# EAGLE design 180dof-pb (EAGLE 5.04)
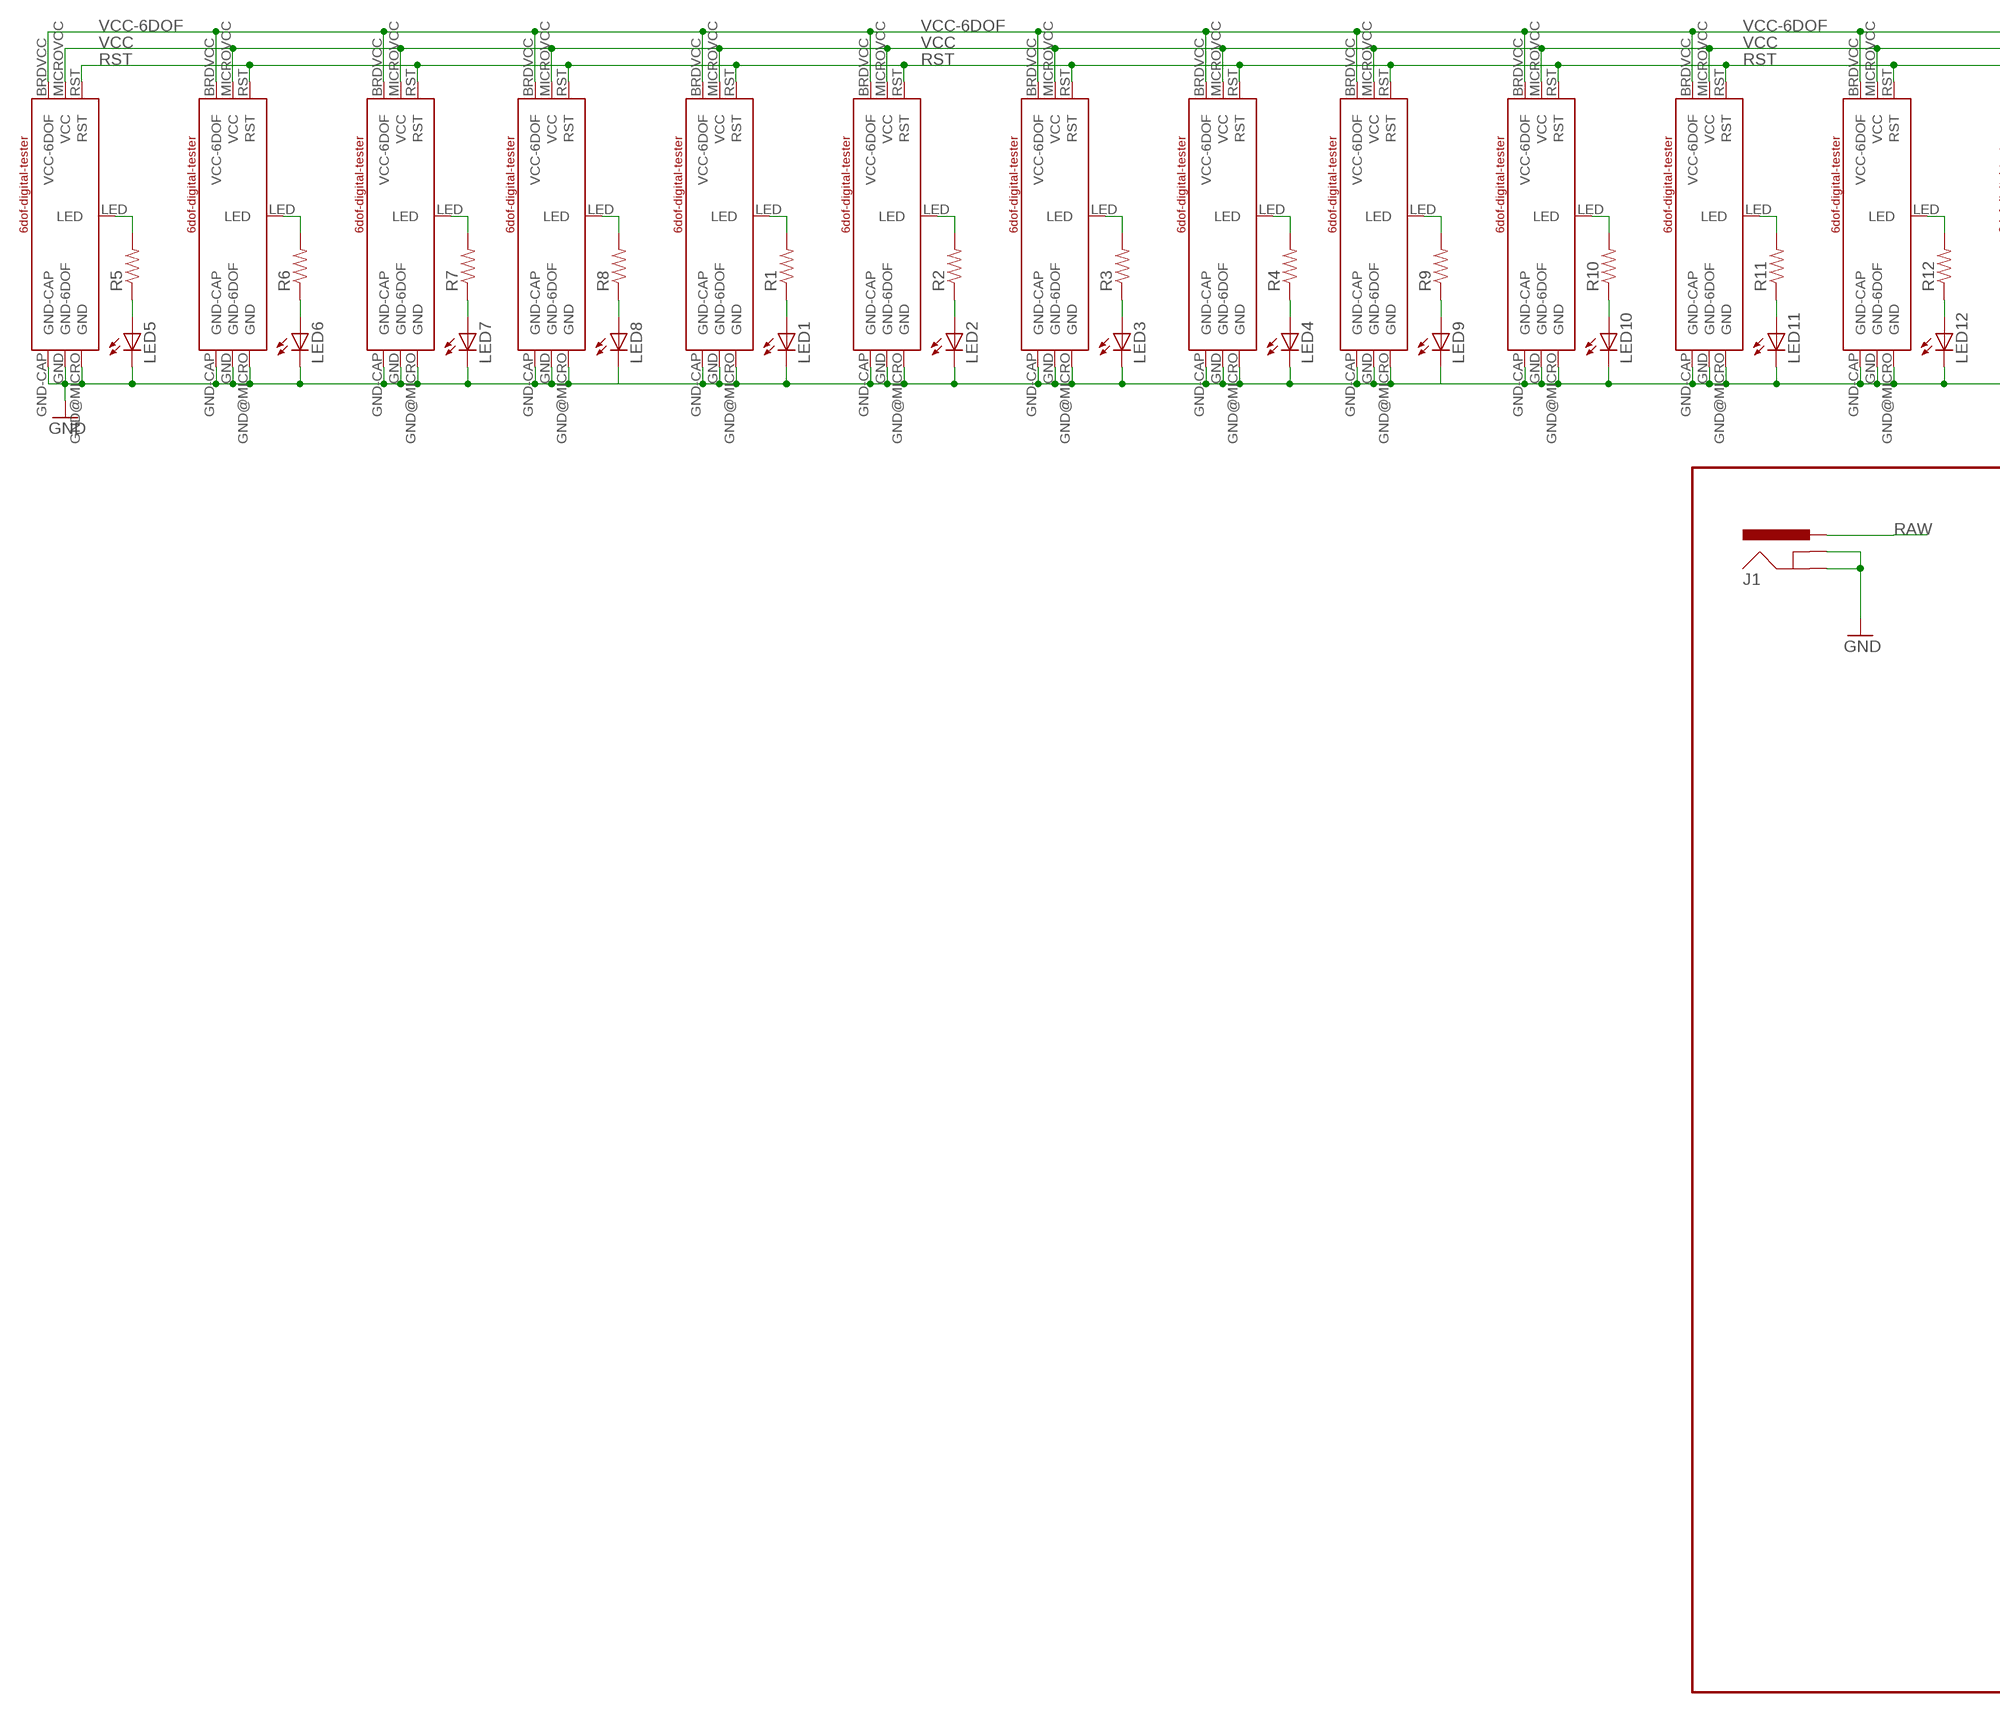
[diagram p0: schematic, sheet 1, part 1 of 2]
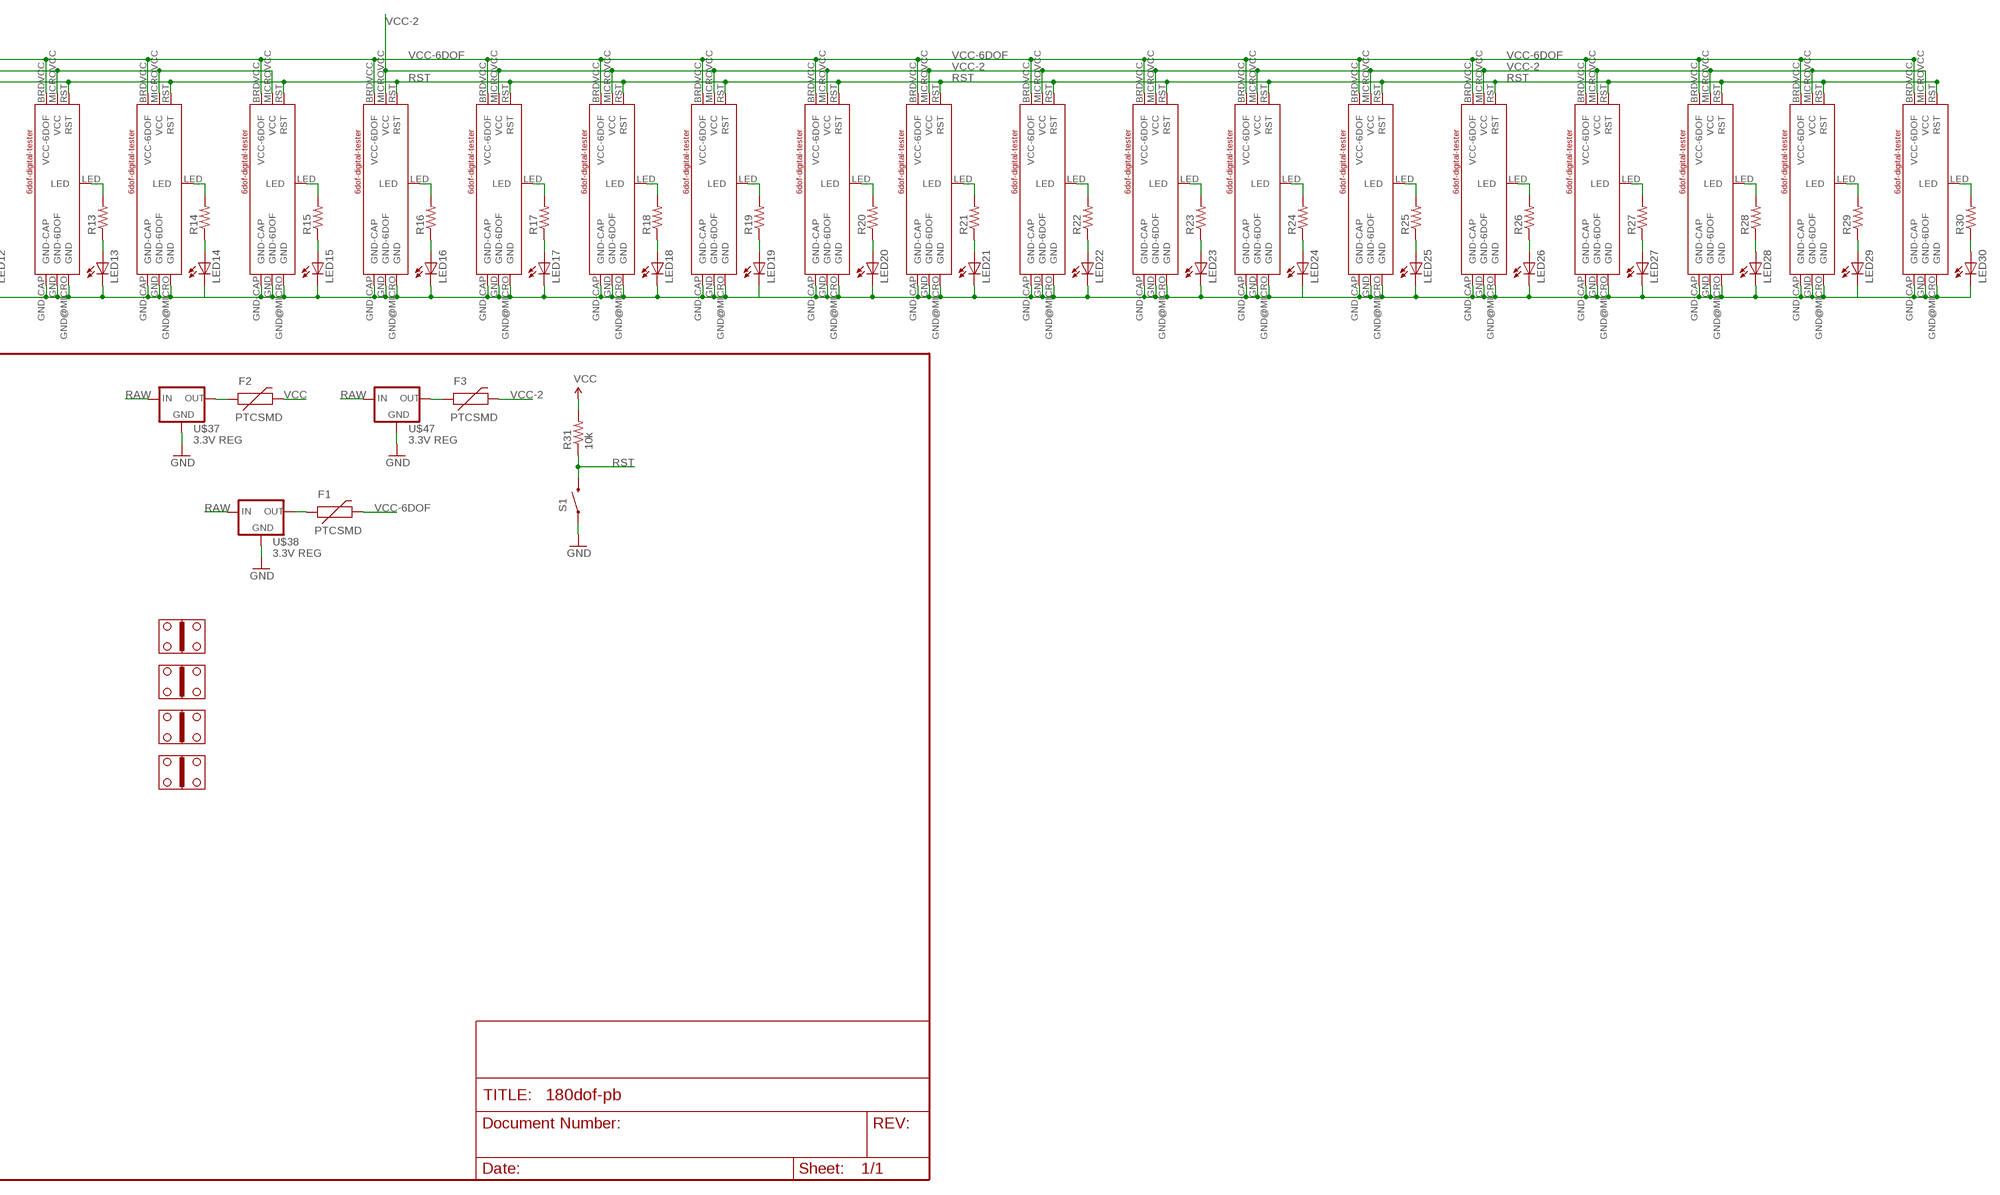
[diagram p1: schematic, sheet 1, part 2 of 2]

## Parts
F1  PTCSMD  [PTC-1206]
F2  PTCSMD  [PTC-1206]
F3  PTCSMD  [PTC-1206]
J1  POWER_JACKPTH  [POWER_JACK_PTH]
LED1  LED1206  [LED-1206]
LED2  LED1206  [LED-1206]
LED3  LED1206  [LED-1206]
LED4  LED1206  [LED-1206]
LED5  LED1206  [LED-1206]
LED6  LED1206  [LED-1206]
LED7  LED1206  [LED-1206]
LED8  LED1206  [LED-1206]
LED9  LED1206  [LED-1206]
LED10  LED1206  [LED-1206]
LED11  LED1206  [LED-1206]
LED12  LED1206  [LED-1206]
LED13  LED1206  [LED-1206]
LED14  LED1206  [LED-1206]
LED15  LED1206  [LED-1206]
LED16  LED1206  [LED-1206]
LED17  LED1206  [LED-1206]
LED18  LED1206  [LED-1206]
LED19  LED1206  [LED-1206]
LED20  LED1206  [LED-1206]
LED21  LED1206  [LED-1206]
LED22  LED1206  [LED-1206]
LED23  LED1206  [LED-1206]
LED24  LED1206  [LED-1206]
LED25  LED1206  [LED-1206]
LED26  LED1206  [LED-1206]
LED27  LED1206  [LED-1206]
LED28  LED1206  [LED-1206]
LED29  LED1206  [LED-1206]
LED30  LED1206  [LED-1206]
R1  RESISTOR0603-RES  [0603-RES]
R2  RESISTOR0603-RES  [0603-RES]
R3  RESISTOR0603-RES  [0603-RES]
R4  RESISTOR0603-RES  [0603-RES]
R5  RESISTOR0603-RES  [0603-RES]
R6  RESISTOR0603-RES  [0603-RES]
R7  RESISTOR0603-RES  [0603-RES]
R8  RESISTOR0603-RES  [0603-RES]
R9  RESISTOR0603-RES  [0603-RES]
R10  RESISTOR0603-RES  [0603-RES]
R11  RESISTOR0603-RES  [0603-RES]
R12  RESISTOR0603-RES  [0603-RES]
R13  RESISTOR0603-RES  [0603-RES]
R14  RESISTOR0603-RES  [0603-RES]
R15  RESISTOR0603-RES  [0603-RES]
R16  RESISTOR0603-RES  [0603-RES]
R17  RESISTOR0603-RES  [0603-RES]
R18  RESISTOR0603-RES  [0603-RES]
R19  RESISTOR0603-RES  [0603-RES]
R20  RESISTOR0603-RES  [0603-RES]
R21  RESISTOR0603-RES  [0603-RES]
R22  RESISTOR0603-RES  [0603-RES]
R23  RESISTOR0603-RES  [0603-RES]
R24  RESISTOR0603-RES  [0603-RES]
R25  RESISTOR0603-RES  [0603-RES]
R26  RESISTOR0603-RES  [0603-RES]
R27  RESISTOR0603-RES  [0603-RES]
R28  RESISTOR0603-RES  [0603-RES]
R29  RESISTOR0603-RES  [0603-RES]
R30  RESISTOR0603-RES  [0603-RES]
R31  10k  RESISTOR0603-RES  [0603-RES]
S1  SWITCH-MOMENTARY-2PTH  [TACTILE-PTH]
U$1  6DOF-DIGITAL-TESTER-DEV  [6DOF-DIGITAL-TESTER]
U$2  6DOF-DIGITAL-TESTER-DEV  [6DOF-DIGITAL-TESTER]
U$3  6DOF-DIGITAL-TESTER-DEV  [6DOF-DIGITAL-TESTER]
U$4  6DOF-DIGITAL-TESTER-DEV  [6DOF-DIGITAL-TESTER]
U$5  6DOF-DIGITAL-TESTER-DEV  [6DOF-DIGITAL-TESTER]
U$6  6DOF-DIGITAL-TESTER-DEV  [6DOF-DIGITAL-TESTER]
U$7  6DOF-DIGITAL-TESTER-DEV  [6DOF-DIGITAL-TESTER]
U$8  6DOF-DIGITAL-TESTER-DEV  [6DOF-DIGITAL-TESTER]
U$9  6DOF-DIGITAL-TESTER-DEV  [6DOF-DIGITAL-TESTER]
U$10  6DOF-DIGITAL-TESTER-DEV  [6DOF-DIGITAL-TESTER]
U$11  6DOF-DIGITAL-TESTER-DEV  [6DOF-DIGITAL-TESTER]
U$12  6DOF-DIGITAL-TESTER-DEV  [6DOF-DIGITAL-TESTER]
U$13  6DOF-DIGITAL-TESTER-DEV  [6DOF-DIGITAL-TESTER]
U$14  6DOF-DIGITAL-TESTER-DEV  [6DOF-DIGITAL-TESTER]
U$15  6DOF-DIGITAL-TESTER-DEV  [6DOF-DIGITAL-TESTER]
U$16  6DOF-DIGITAL-TESTER-DEV  [6DOF-DIGITAL-TESTER]
U$17  6DOF-DIGITAL-TESTER-DEV  [6DOF-DIGITAL-TESTER]
U$18  6DOF-DIGITAL-TESTER-DEV  [6DOF-DIGITAL-TESTER]
U$19  6DOF-DIGITAL-TESTER-DEV  [6DOF-DIGITAL-TESTER]
U$20  6DOF-DIGITAL-TESTER-DEV  [6DOF-DIGITAL-TESTER]
U$21  6DOF-DIGITAL-TESTER-DEV  [6DOF-DIGITAL-TESTER]
U$22  6DOF-DIGITAL-TESTER-DEV  [6DOF-DIGITAL-TESTER]
U$23  6DOF-DIGITAL-TESTER-DEV  [6DOF-DIGITAL-TESTER]
U$24  6DOF-DIGITAL-TESTER-DEV  [6DOF-DIGITAL-TESTER]
U$25  6DOF-DIGITAL-TESTER-DEV  [6DOF-DIGITAL-TESTER]
U$26  6DOF-DIGITAL-TESTER-DEV  [6DOF-DIGITAL-TESTER]
U$27  6DOF-DIGITAL-TESTER-DEV  [6DOF-DIGITAL-TESTER]
U$28  6DOF-DIGITAL-TESTER-DEV  [6DOF-DIGITAL-TESTER]
U$29  6DOF-DIGITAL-TESTER-DEV  [6DOF-DIGITAL-TESTER]
U$30  6DOF-DIGITAL-TESTER-DEV  [6DOF-DIGITAL-TESTER]
U$37  3.3V REG  V_REG_LD1117VXX  [78XXL]
U$38  3.3V REG  V_REG_LD1117VXX  [78XXL]
U$47  3.3V REG  V_REG_LD1117VXX  [78XXL]
U$48  GOLD_HINDGESTANDARD  [GOLD_HINDGE]
U$49  GOLD_HINDGESTANDARD  [GOLD_HINDGE]
U$50  GOLD_HINDGESTANDARD  [GOLD_HINDGE]
U$51  GOLD_HINDGESTANDARD  [GOLD_HINDGE]

## Nets
GND: J1.GND J1.GNDBREAK LED1.C LED2.C LED3.C LED4.C LED5.C LED6.C LED7.C LED8.C LED9.C LED10.C LED11.C LED12.C LED13.C LED14.C LED15.C LED16.C LED17.C LED18.C LED19.C LED20.C LED21.C LED22.C LED23.C LED24.C LED25.C LED26.C LED27.C LED28.C LED29.C LED30.C S1.1 U$1.GND(GND-6DOF) U$1.GND-CAP U$1.GND@MICRO(GND) U$2.GND(GND-6DOF) U$2.GND-CAP U$2.GND@MICRO(GND) U$3.GND(GND-6DOF) U$3.GND-CAP U$3.GND@MICRO(GND) U$4.GND(GND-6DOF) U$4.GND-CAP U$4.GND@MICRO(GND) U$5.GND(GND-6DOF) U$5.GND-CAP U$5.GND@MICRO(GND) U$6.GND(GND-6DOF) U$6.GND-CAP U$6.GND@MICRO(GND) U$7.GND(GND-6DOF) U$7.GND-CAP U$7.GND@MICRO(GND) U$8.GND(GND-6DOF) U$8.GND-CAP U$8.GND@MICRO(GND) U$9.GND(GND-6DOF) U$9.GND-CAP U$9.GND@MICRO(GND) U$10.GND(GND-6DOF) U$10.GND-CAP U$10.GND@MICRO(GND) U$11.GND(GND-6DOF) U$11.GND-CAP U$11.GND@MICRO(GND) U$12.GND(GND-6DOF) U$12.GND-CAP U$12.GND@MICRO(GND) U$13.GND(GND-6DOF) U$13.GND-CAP U$13.GND@MICRO(GND) U$14.GND(GND-6DOF) U$14.GND-CAP U$14.GND@MICRO(GND) U$15.GND(GND-6DOF) U$15.GND-CAP U$15.GND@MICRO(GND) U$16.GND(GND-6DOF) U$16.GND-CAP U$16.GND@MICRO(GND) U$17.GND(GND-6DOF) U$17.GND-CAP U$17.GND@MICRO(GND) U$18.GND(GND-6DOF) U$18.GND-CAP U$18.GND@MICRO(GND) U$19.GND(GND-6DOF) U$19.GND-CAP U$19.GND@MICRO(GND) U$20.GND(GND-6DOF) U$20.GND-CAP U$20.GND@MICRO(GND) U$21.GND(GND-6DOF) U$21.GND-CAP U$21.GND@MICRO(GND) U$22.GND(GND-6DOF) U$22.GND-CAP U$22.GND@MICRO(GND) U$23.GND(GND-6DOF) U$23.GND-CAP U$23.GND@MICRO(GND) U$24.GND(GND-6DOF) U$24.GND-CAP U$24.GND@MICRO(GND) U$25.GND(GND-6DOF) U$25.GND-CAP U$25.GND@MICRO(GND) U$26.GND(GND-6DOF) U$26.GND-CAP U$26.GND@MICRO(GND) U$27.GND(GND-6DOF) U$27.GND-CAP U$27.GND@MICRO(GND) U$28.GND(GND-6DOF) U$28.GND-CAP U$28.GND@MICRO(GND) U$29.GND(GND-6DOF) U$29.GND-CAP U$29.GND@MICRO(GND) U$30.GND(GND-6DOF) U$30.GND-CAP U$30.GND@MICRO(GND) U$37.IN(GND) U$38.IN(GND) U$47.IN(GND)
N$1: R5.2 U$5.LED
N$2: LED5.A R5.1
N$3: R6.2 U$6.LED
N$4: LED6.A R6.1
N$5: R7.2 U$7.LED
N$6: LED7.A R7.1
N$7: R8.2 U$8.LED
N$8: LED8.A R8.1
N$9: R1.2 U$1.LED
N$10: LED1.A R1.1
N$11: R2.2 U$2.LED
N$12: LED2.A R2.1
N$13: R3.2 U$3.LED
N$14: LED3.A R3.1
N$15: R4.2 U$4.LED
N$16: LED4.A R4.1
N$17: R9.2 U$9.LED
N$18: LED9.A R9.1
N$19: R10.2 U$10.LED
N$20: LED10.A R10.1
N$21: R11.2 U$11.LED
N$22: LED11.A R11.1
N$23: R12.2 U$12.LED
N$24: LED12.A R12.1
N$25: R13.2 U$13.LED
N$26: LED13.A R13.1
N$27: R14.2 U$14.LED
N$28: LED14.A R14.1
N$29: R15.2 U$15.LED
N$30: LED15.A R15.1
N$31: R16.2 U$16.LED
N$32: LED16.A R16.1
N$33: R17.2 U$17.LED
N$34: LED17.A R17.1
N$35: R18.2 U$18.LED
N$36: LED18.A R18.1
N$37: R19.2 U$19.LED
N$38: LED19.A R19.1
N$39: R20.2 U$20.LED
N$40: LED20.A R20.1
N$41: LED30.A R30.1
N$42: R30.2 U$30.LED
N$43: R29.2 U$29.LED
N$44: LED29.A R29.1
N$45: LED28.A R28.1
N$46: R28.2 U$28.LED
N$47: R27.2 U$27.LED
N$48: LED27.A R27.1
N$49: R26.2 U$26.LED
N$50: LED26.A R26.1
N$51: R25.2 U$25.LED
N$52: LED25.A R25.1
N$53: R24.2 U$24.LED
N$54: LED24.A R24.1
N$55: R21.2 U$21.LED
N$56: LED21.A R21.1
N$57: R22.2 U$22.LED
N$58: LED22.A R22.1
N$59: R23.2 U$23.LED
N$60: LED23.A R23.1
N$61: F1.1 U$38.GND(OUT)
N$64: F2.1 U$37.GND(OUT)
N$65: F3.1 U$47.GND(OUT)
RAW: J1.PWR U$37.OUT(IN) U$38.OUT(IN) U$47.OUT(IN)
RST: R31.1 S1.3 U$1.RST U$2.RST U$3.RST U$4.RST U$5.RST U$6.RST U$7.RST U$8.RST U$9.RST U$10.RST U$11.RST U$12.RST U$13.RST U$14.RST U$15.RST U$16.RST U$17.RST U$18.RST U$19.RST U$20.RST U$21.RST U$22.RST U$23.RST U$24.RST U$25.RST U$26.RST U$27.RST U$28.RST U$29.RST U$30.RST
VCC: F2.2 R31.2 U$1.MICROVCC(VCC) U$2.MICROVCC(VCC) U$3.MICROVCC(VCC) U$4.MICROVCC(VCC) U$5.MICROVCC(VCC) U$6.MICROVCC(VCC) U$7.MICROVCC(VCC) U$8.MICROVCC(VCC) U$9.MICROVCC(VCC) U$10.MICROVCC(VCC) U$11.MICROVCC(VCC) U$12.MICROVCC(VCC) U$13.MICROVCC(VCC) U$14.MICROVCC(VCC) U$15.MICROVCC(VCC)
VCC-2: F3.2 U$16.MICROVCC(VCC) U$17.MICROVCC(VCC) U$18.MICROVCC(VCC) U$19.MICROVCC(VCC) U$20.MICROVCC(VCC) U$21.MICROVCC(VCC) U$22.MICROVCC(VCC) U$23.MICROVCC(VCC) U$24.MICROVCC(VCC) U$25.MICROVCC(VCC) U$26.MICROVCC(VCC) U$27.MICROVCC(VCC) U$28.MICROVCC(VCC) U$29.MICROVCC(VCC) U$30.MICROVCC(VCC)
VCC-6DOF: F1.2 U$1.BRDVCC(VCC-6DOF) U$2.BRDVCC(VCC-6DOF) U$3.BRDVCC(VCC-6DOF) U$4.BRDVCC(VCC-6DOF) U$5.BRDVCC(VCC-6DOF) U$6.BRDVCC(VCC-6DOF) U$7.BRDVCC(VCC-6DOF) U$8.BRDVCC(VCC-6DOF) U$9.BRDVCC(VCC-6DOF) U$10.BRDVCC(VCC-6DOF) U$11.BRDVCC(VCC-6DOF) U$12.BRDVCC(VCC-6DOF) U$13.BRDVCC(VCC-6DOF) U$14.BRDVCC(VCC-6DOF) U$15.BRDVCC(VCC-6DOF) U$16.BRDVCC(VCC-6DOF) U$17.BRDVCC(VCC-6DOF) U$18.BRDVCC(VCC-6DOF) U$19.BRDVCC(VCC-6DOF) U$20.BRDVCC(VCC-6DOF) U$21.BRDVCC(VCC-6DOF) U$22.BRDVCC(VCC-6DOF) U$23.BRDVCC(VCC-6DOF) U$24.BRDVCC(VCC-6DOF) U$25.BRDVCC(VCC-6DOF) U$26.BRDVCC(VCC-6DOF) U$27.BRDVCC(VCC-6DOF) U$28.BRDVCC(VCC-6DOF) U$29.BRDVCC(VCC-6DOF) U$30.BRDVCC(VCC-6DOF)

## Library data of the parts
F1-F3 = SparkFun:PTC: Resettable Fuse PTC Resettable Fuse. Spark Fun Electronics SKU : COM-08357
J1 = SparkFun:POWER_JACK: Power Jack This is the standard 5.5mm barrel jack for power. The PTH is the most common, proven, reliable, footprint. All others are experimental. The Slot footprint only works if the mill layer is transmitted to the PCB fab house so be warned. Spark Fun Electronics SKU : PRT-00119. Mating wall wart : TOL-00298 (and others)
LED1-LED30 = unclepetes:LED: LEDs Standard schematic elements and footprints for 5mm, 3mm, 1206, and 0603 sized LEDs. 5mm - Spark Fun Electronics SKU : COM-00529 (and others)
R1-R31 = SparkFun:RESISTOR: Resistor Basic schematic elements and footprints for 0603, 1206, and PTH resistors.
S1 = SparkFun:SWITCH-MOMENTARY-2
U$1-U$30 = unclepetes:6DOF-DIGITAL-TESTER-DEV
U$37 U$38 U$47 = SparkFun:V_REG_LD1117VXX: LD1117VXX voltage regulator. We carry the 3.3V version (COM-00526) in TO-220 package.
U$48-U$51 = JoelEB:GOLD_HINDGE

## Board
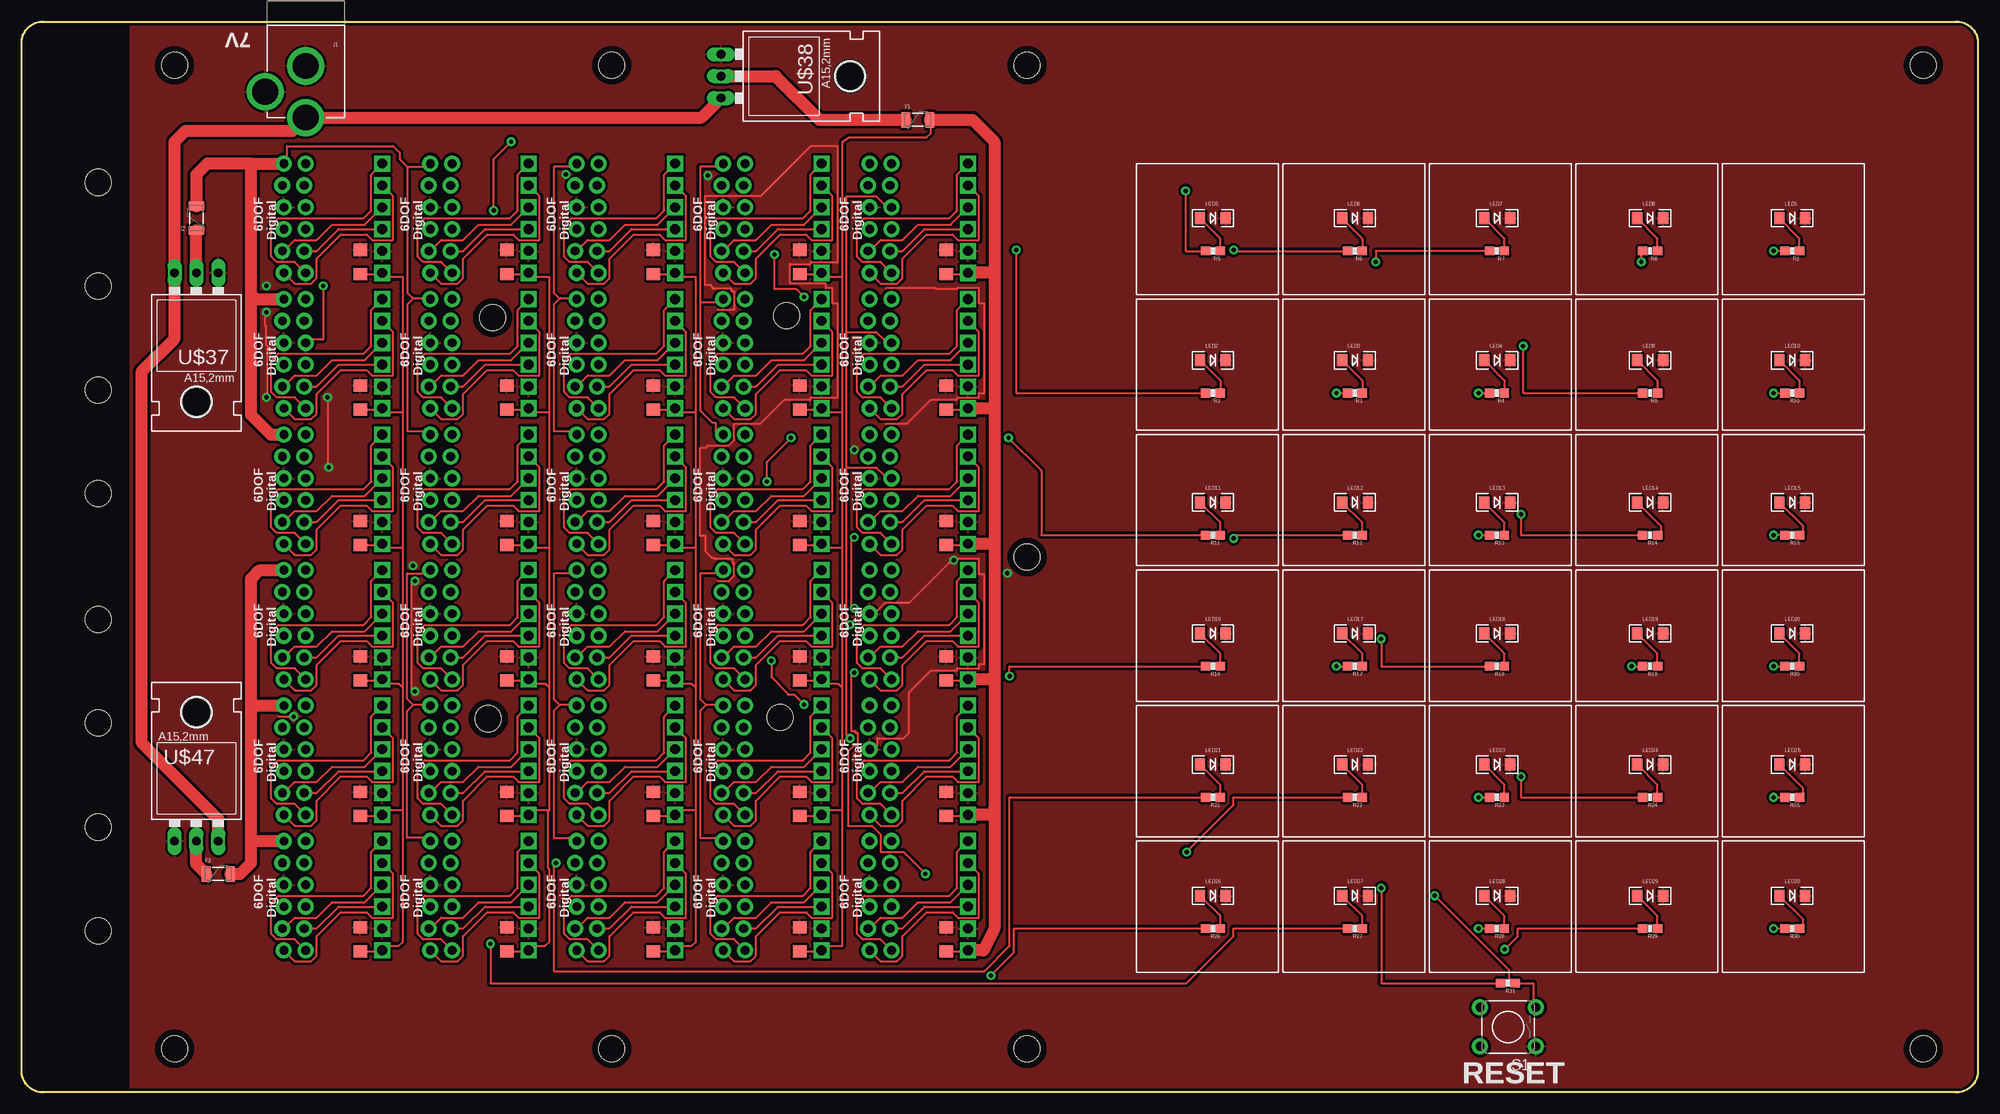
[diagram p2: board, top side]
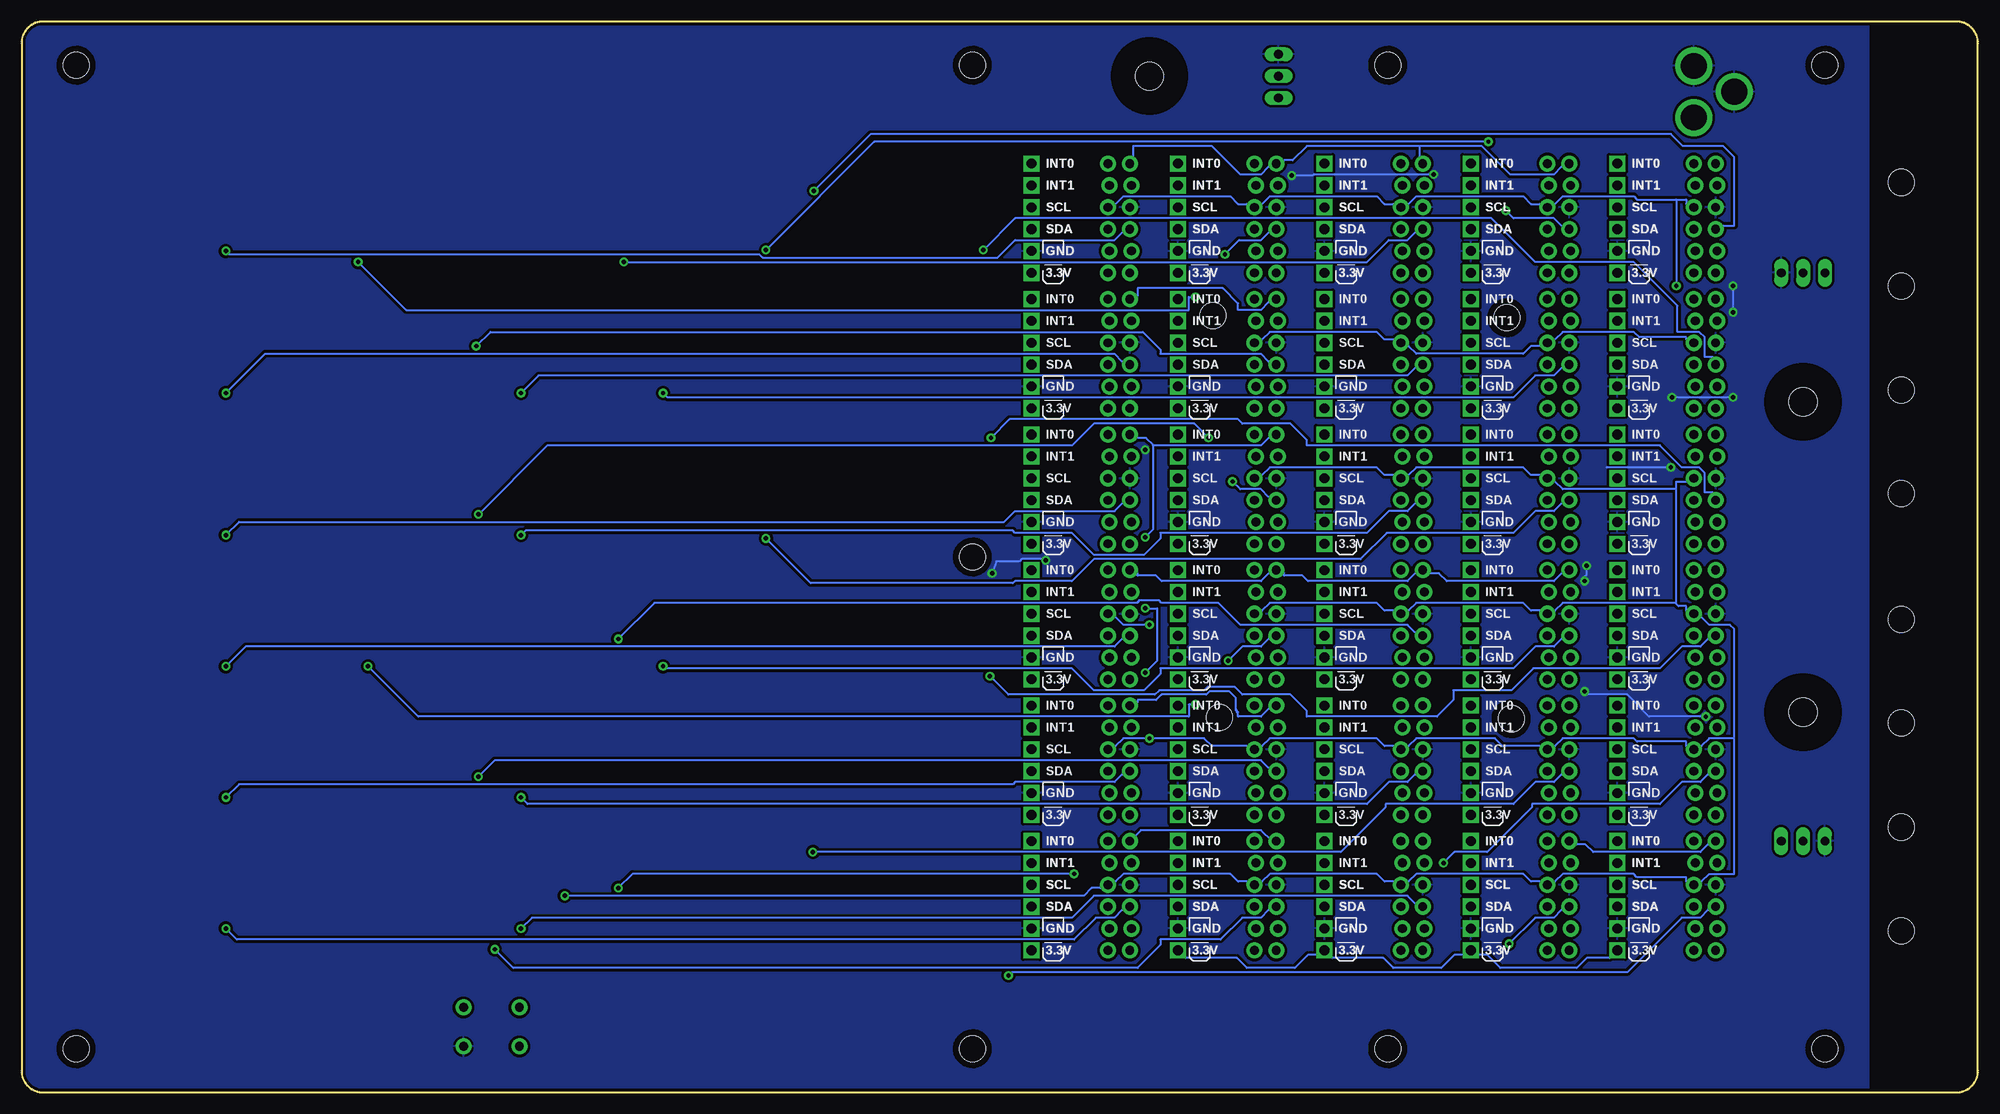
[diagram p3: board, bottom side, seen from below]

Size 227.33 x 124.46 mm. Coordinates in mm from the lower left corner, seen from the top.
Outline: 2.54,0 arc-90 0,2.54 0,121.92 arc-90 2.54,124.46 224.79,124.46 arc-90 227.33,121.92 227.33,2.54 arc-90 224.79,0 2.54,0
Copper layers (1*16): Top 0.035mm / dielectric 1.5mm / Bottom 0.035mm
Design rules "SparkFun *": minimum track width 10mil, minimum drill 20mil, track to track 8mil, track to pad 8mil, pad to pad 8mil, via to via 8mil, smd to smd 8mil, copper to edge 8mil, drill to drill 8mil, minimum pad ring 12mil, minimum via ring 10mil, stop-mask expansion 4mil, vias tented up to drill 20mil, thermal gap 10mil

### Footprints (pad centres in the part's own frame; a part is rotated, then mirrored left to right if it is on the bottom)
PTC-1206 = smd 1 x 1.8: 1 -1.4,0; 2 1.4,0
POWER_JACK_PTH = drill 2.997 pad 4.318 round: GND 0,7.7; GNDBREAK 4.7,10.7; PWR 0,13.7
LED-1206 = smd 1.2 x 1.4: A -1.5,0; C 1.5,0
0603-RES = smd 1.1 x 1: 1 -0.85,0; 2 0.85,0
TACTILE-PTH = drill 1.016 pad 1.88 round: 1 -3.251,2.261; 2 3.251,2.261; 3 -3.251,-2.261; 4 3.251,-2.261
6DOF-DIGITAL-TESTER = drill 1.118 pad 1.88 square: BRDVCC 15.24,1.27; GND 15.24,3.81; P$1 15.24,13.97; P$2 15.24,11.43; P$3 15.24,8.89; P$4 15.24,6.35 | smd 1.6 x 1.4: CAP-VCC 12.7,1.14; GND-CAP 12.7,3.94 | drill 1.016 pad 1.88 round: GND@MICRO 3.81,8.89; LED 3.81,6.35; MICROVCC 3.81,13.97; P2 3.632,11.43; P5 3.632,3.81; P6 3.81,1.27; P7 6.35,1.27; P8 6.172,3.81; P9 6.35,6.35; P11 6.172,11.43; P12 6.35,13.97; RST 6.35,8.89
STAND-OFF-TIGHT = hole 3.048: 0,0
78XXL = drill 1.016 long: GND 0,-3.81; IN -2.54,-3.81; OUT 2.54,-3.81 | hole 3.302: 0,11.176
GOLD_HINDGE = hole 3.048: 3.81,3.556; 3.81,15.591

### Placement (x,y rotation side)
F1  104.14,113.03 0 top
F2  20.32,101.6 90 top
F3  22.86,25.4 0 top
J1  33.02,127 180 top
LED1  205.74,101.6 0 top
LED2  138.43,85.09 0 top
LED3  154.94,85.09 0 top
LED4  171.45,85.09 0 top
LED5  138.43,101.6 0 top
LED6  154.94,101.6 0 top
LED7  171.45,101.6 0 top
LED8  189.23,101.6 0 top
LED9  189.23,85.09 0 top
LED10  205.74,85.09 0 top
LED11  138.43,68.58 0 top
LED12  154.94,68.58 0 top
LED13  171.45,68.58 0 top
LED14  189.23,68.58 0 top
LED15  205.74,68.58 0 top
LED16  138.43,53.34 0 top
LED17  154.94,53.34 0 top
LED18  171.45,53.34 0 top
LED19  189.23,53.34 0 top
LED20  205.74,53.34 0 top
LED21  138.43,38.1 0 top
LED22  154.94,38.1 0 top
LED23  171.45,38.1 0 top
LED24  189.23,38.1 0 top
LED25  205.74,38.1 0 top
LED26  138.43,22.86 0 top
LED27  154.94,22.86 0 top
LED28  171.45,22.86 0 top
LED29  189.23,22.86 0 top
LED30  205.74,22.86 0 top
R1  205.74,97.79 180 top
R2  138.43,81.28 180 top
R3  154.94,81.28 180 top
R4  171.45,81.28 180 top
R5  138.43,97.79 180 top
R6  154.94,97.79 180 top
R7  171.45,97.79 180 top
R8  189.23,97.79 180 top
R9  189.23,81.28 180 top
R10  205.74,81.28 180 top
R11  138.43,64.77 180 top
R12  154.94,64.77 180 top
R13  171.45,64.77 180 top
R14  189.23,64.77 180 top
R15  205.74,64.77 180 top
R16  138.43,49.53 180 top
R17  154.94,49.53 180 top
R18  171.45,49.53 180 top
R19  189.23,49.53 180 top
R20  205.74,49.53 180 top
R21  138.43,34.29 180 top
R22  154.94,34.29 180 top
R23  171.45,34.29 180 top
R24  189.23,34.29 180 top
R25  205.74,34.29 180 top
R26  138.43,19.05 180 top
R27  154.94,19.05 180 top
R28  171.45,19.05 180 top
R29  189.23,19.05 180 top
R30  205.74,19.05 180 top
R31  172.72,12.7 180 top
S1  172.72,7.62 180 top
U$1  94.74,93.98 0 top
U$2  26.67,78.23 0 top
U$3  43.69,78.23 0 top
U$4  60.71,78.23 0 top
U$5  26.67,93.98 0 top
U$6  43.69,93.98 0 top
U$7  60.71,93.98 0 top
U$8  77.72,93.98 0 top
U$9  77.72,78.23 0 top
U$10  94.74,78.23 0 top
U$11  26.67,62.48 0 top
U$12  43.69,62.48 0 top
U$13  60.71,62.48 0 top
U$14  77.72,62.48 0 top
U$15  94.74,62.48 0 top
U$16  26.67,46.74 0 top
U$17  43.69,46.74 0 top
U$18  60.71,46.74 0 top
U$19  77.72,46.74 0 top
U$20  94.74,46.74 0 top
U$21  26.67,30.99 0 top
U$22  43.69,30.99 0 top
U$23  60.71,30.99 0 top
U$24  77.72,30.99 0 top
U$25  94.74,30.99 0 top
U$26  26.67,15.24 0 top
U$27  43.69,15.24 0 top
U$28  60.71,15.24 0 top
U$29  77.72,15.24 0 top
U$30  94.74,15.24 0 top
U$32  [STAND-OFF-TIGHT]  116.84,119.38 0 top
U$33  [STAND-OFF-TIGHT]  116.84,62.23 0 top
U$34  [STAND-OFF-TIGHT]  220.98,119.38 0 top
U$35  [STAND-OFF-TIGHT]  220.98,5.08 0 top
U$36  [STAND-OFF-TIGHT]  88.14,43.56 0 top
U$37  20.32,91.44 180 top
U$38  85.09,118.11 270 top
U$39  [STAND-OFF-TIGHT]  54.74,90.04 0 top
U$40  [STAND-OFF-TIGHT]  88.9,90.3 0 top
U$41  [STAND-OFF-TIGHT]  17.78,5.08 0 top
U$42  [STAND-OFF-TIGHT]  68.58,5.08 0 top
U$43  [STAND-OFF-TIGHT]  116.84,5.08 0 top
U$44  [STAND-OFF-TIGHT]  17.78,119.38 0 top
U$45  [STAND-OFF-TIGHT]  68.58,119.38 0 top
U$46  [STAND-OFF-TIGHT]  54.23,43.43 0 top
U$47  20.32,33.02 0 top
U$48  5.08,90.17 0 top
U$49  5.08,66.04 0 top
U$50  5.08,39.37 0 top
U$51  5.08,15.24 0 top

### Tracks (layer width: path | path; a pad name or v marks a point on that pad's centre or on a via)
GND  (via drill 0.51)
  Top 0.254: v31.62,43.69 29.97,43.69 29.87,43.73 | v45.72,46.61 45.34,46.61 45.34,59.44 v45.72,59.44 | v35.69,72.64 35.56,72.77 v35.56,80.77 | v28.45,80.77 28.45,81.03 28.57,81.03 28.57,86.74 28.45,86.87 28.45,89.03 28.32,89.15 28.32,90.17 28.45,90.3 v28.45,90.68 | 84.45,104.14 85.85,104.14 91.69,109.98 94.87,109.98 94.87,96.52 91.69,96.52 91.69,96.27 89.28,96.27 89.28,94.11 89.41,94.11 89.41,93.98 93.47,93.98 93.47,93.47 94.23,93.47 94.23,91.69 94.87,91.69 94.87,80.77 91.69,80.77 91.69,80.52 88.65,80.52 85.85,77.72 82.8,77.72 82.8,75.82 82.17,75.18 79.76,75.18 79.5,74.93 78.87,74.93 78.87,64.64 79.5,64.64 79.5,62.87 80.26,62.1 80.52,62.1 80.52,61.98 82.68,61.98 82.68,61.47 82.8,61.47 82.8,60.07 82.17,59.44 81.03,59.44 80.93,59.47 | 84.45,104.14 79.38,104.14 79.38,93.85 80.01,93.85 80.26,93.6 80.26,93.47 82.42,93.47 82.42,93.22 82.55,93.22 82.55,93.09 82.8,93.09 82.8,90.93 81.03,90.93 80.93,90.97 | 100.45,93.42 100.46,93.47 106.17,93.47 106.3,93.34 108.71,93.34 108.71,93.47 111.25,93.47 111.25,91.69 111.89,91.69 111.89,81.28 111.25,81.28 111.25,80.77 108.71,80.77 108.71,80.52 105.66,80.52 102.87,77.72 100.46,77.72 100.45,77.67 | U$20.GND@MICRO 99.44,56.01 100.33,56.9 103.12,56.9 108.08,61.85 v108.33,61.85 108.71,61.85 108.71,61.98 111.25,61.98 111.25,60.2 111.89,60.2 111.89,49.78 111.25,49.78 111.25,49.28 108.71,49.28 108.71,49.02 105.66,49.02 103.12,46.48 103.12,41.78 102.49,41.15 99.44,41.15 99.44,40.26 U$25.GND@MICRO | 84.45,104.14 84.5,104.18
  Bottom 0.254: v31.62,43.69 38.23,43.69 40.77,46.23 45.34,46.23 v45.72,46.61 | v45.72,59.44 45.72,59.94 45.47,60.2 v45.47,61.21 | v28.45,80.77 v35.56,80.77 | v28.45,90.68 v28.45,93.73 | v35.69,72.64 43.13,72.64 | v114.55,60.33 114.05,61.72 111.38,61.72 111.12,61.98 108.46,61.98 v108.33,61.85 | v79.76,106.55 77.34,106.55 77.22,106.68 v63.25,106.68
  other vias: 96.77,74.68
  pour Bottom (isolate 0.305): 12.7,0 12.7,124.46 227.33,124.46 227.33,0
  pour Top (isolate 0.305): 12.7,0 12.7,124.46 227.33,124.46 227.33,0
N$1  (via drill 0.51)
  Top 0.254: v135.25,104.78 135.25,97.79 R5.2
  Bottom 0.254: v135.25,104.78 128.65,111.38 35.69,111.38 34.29,109.98 29.59,109.98 28.32,108.71 28.32,100.71 29.59,100.71 U$5.LED
N$2
  Top 0.254: R5.1 139.28,99.25 LED5.A
N$3  (via drill 0.51)
  Top 0.254: v140.84,97.92 140.84,97.79 R6.2 | v56.9,110.49 54.86,108.46 v54.86,102.49
  Bottom 0.254: v140.84,97.92 128.27,110.49 v56.9,110.49 | v54.86,102.49 53.98,101.6 49.28,101.6 48.39,100.71 U$6.LED
N$4
  Top 0.254: R6.1 155.79,99.25 LED6.A
N$5  (via drill 0.51)
  Top 0.254: v157.35,96.52 157.35,97.79 R7.2
  Bottom 0.254: v157.35,96.52 70.99,96.52 68.45,99.06 66.29,99.06 65.41,99.95 U$7.LED
N$6
  Top 0.254: R7.1 172.3,99.25 LED7.A
N$7  (via drill 0.51)
  Top 0.254: v188.21,96.52 188.21,97.41 R8.2 | v90.93,92.46 90.04,93.34 87.5,93.34 v87.5,97.41
  Bottom 0.254: v188.21,96.52 182.63,90.93 91.69,90.93 91.69,92.46 v90.93,92.46 | v87.5,97.41 85.85,99.06 83.31,99.06 82.42,99.95 U$8.LED
N$8
  Top 0.254: R8.1 190.08,99.25 LED8.A
N$9  (via drill 0.51)
  Top 0.254: R1.2 v203.58,97.79
  Bottom 0.254: v203.58,97.79 203.2,97.41 141.6,97.41 141.22,97.03 113.92,97.03 111.89,99.06 100.33,99.06 99.44,99.95 U$1.LED
N$10
  Top 0.254: R1.1 206.59,99.25 LED1.A
N$11  (via drill 0.51)
  Top 0.254: v115.57,97.92 115.57,81.28 R2.2
  Bottom 0.254: v115.57,97.92 111.89,101.6 56.52,101.6 51.44,96.52 40.01,96.52 34.92,91.44 34.92,88.39 32.38,88.39 31.75,87.76 31.75,85.47 30.86,85.47 U$2.LED
N$12
  Top 0.254: R2.1 139.28,82.74 LED2.A
N$13  (via drill 0.51)
  Top 0.254: v152.78,81.28 R3.2
  Bottom 0.254: v152.78,81.28 152.27,80.77 53.98,80.77 51.44,83.31 49.28,83.31 48.39,84.2 U$3.LED
N$14
  Top 0.254: R3.1 155.79,82.74 LED3.A
N$15  (via drill 0.51)
  Top 0.254: v169.29,81.28 R4.2
  Bottom 0.254: v169.29,81.28 167.26,83.31 66.29,83.31 65.41,84.2 U$4.LED
N$16
  Top 0.254: R4.1 172.3,82.74 LED4.A
N$17  (via drill 0.51)
  Top 0.254: v174.5,86.74 174.5,81.28 R9.2
  Bottom 0.254: v174.5,86.74 172.85,88.39 97.03,88.39 95,86.36 95,85.85 83.31,85.85 82.42,84.96 U$9.LED
N$18
  Top 0.254: R9.1 190.08,82.74 LED9.A
N$19  (via drill 0.51)
  Top 0.254: v203.58,81.28 R10.2
  Bottom 0.254: v203.58,81.28 199.01,85.85 100.33,85.85 99.44,84.96 U$10.LED
N$20
  Top 0.254: R10.1 206.59,82.74 LED10.A
N$21  (via drill 0.51)
  Top 0.254: v114.68,76.07 118.49,72.26 118.49,64.77 R11.2
  Bottom 0.254: v114.68,76.07 112.52,78.23 85.98,78.23 85.47,77.72 79.88,77.72 77.98,75.82 77.98,75.18 36.96,75.18 34.42,72.64 32.38,72.64 31.75,72.01 31.75,69.72 30.86,69.72 U$11.LED
N$22
  Top 0.254: R11.1 139.28,66.23 LED11.A
N$23  (via drill 0.51)
  Top 0.254: v140.84,64.39 140.84,64.77 R12.2
  Bottom 0.254: v140.84,64.39 135.64,59.18 112.14,59.18 111.89,59.44 105.28,59.44 102.74,61.98 71.75,61.98 68.71,65.02 53.98,65.02 51.44,67.56 49.28,67.56 48.39,68.45 U$12.LED
N$24
  Top 0.254: R12.1 155.79,66.23 LED12.A
N$25  (via drill 0.51)
  Top 0.254: v169.29,64.77 R13.2
  Bottom 0.254: v169.29,64.77 168.78,65.28 112.14,65.28 111.89,65.02 105.28,65.02 102.74,62.48 96.9,62.48 95,64.39 95,65.02 70.99,65.02 68.45,67.56 66.29,67.56 65.41,68.45 U$13.LED
N$26
  Top 0.254: R13.1 172.3,66.23 LED13.A
N$27  (via drill 0.51)
  Top 0.254: v174.24,67.18 174.24,64.77 R14.2 | v89.41,76.07 86.61,73.28 v86.61,70.99
  Bottom 0.254: v174.24,67.18 166.24,75.18 105.28,75.18 102.74,77.72 91.06,77.72 v89.41,76.07 | v86.61,70.99 85.72,70.1 83.31,70.1 82.42,69.22 U$14.LED
N$28
  Top 0.254: R14.1 190.5,64.77 190.5,65.81 LED14.A
N$29  (via drill 0.51)
  Top 0.254: R15.2 v203.58,64.77
  Bottom 0.254: v203.58,64.77 202.06,66.29 113.16,66.29 111.89,67.56 100.33,67.56 99.44,68.45 U$15.LED
N$30
  Top 0.254: R15.1 207.01,64.77 207.01,65.81 LED15.A
N$31  (via drill 0.51)
  Top 0.254: v114.81,48.39 114.81,49.53 R16.2
  Bottom 0.254: v114.81,48.39 112.65,46.23 95.63,46.23 95.12,46.74 89.92,46.74 89.53,47.12 86.36,47.12 85.47,46.23 79.88,46.23 77.98,44.32 77.98,43.69 62.87,43.69 60.96,45.59 60.96,46.74 54.23,46.74 51.69,49.28 36.96,49.28 34.42,51.82 32.26,51.82 31.37,52.7 U$16.LED
N$32
  Top 0.254: R16.1 139.28,50.99 LED16.A
N$33  (via drill 0.51)
  Top 0.254: v152.78,49.53 R17.2
  Bottom 0.254: v152.78,49.53 152.53,49.28 105.28,49.28 102.74,46.74 96.9,46.74 95,48.64 95,49.28 53.98,49.28 51.44,51.82 49.28,51.82 48.39,52.7 U$17.LED
N$34
  Top 0.254: R17.1 155.79,50.99 LED17.A
N$35  (via drill 0.51)
  Top 0.254: v157.99,52.7 157.99,49.53 R18.2
  Bottom 0.254: v157.99,52.7 153.8,56.9 97.66,56.9 97.66,57.02 97.54,57.02 97.54,57.15 95.12,57.15 94.87,56.9 88.27,56.9 85.72,54.36 66.29,54.36 65.41,53.47 U$18.LED
N$36
  Top 0.254: R18.1 172.3,50.99 LED18.A
N$37  (via drill 0.51)
  Top 0.254: v90.93,45.09 89.79,46.23 89.03,46.23 89.03,46.35 87.12,48.26 v87.12,50.16 | v187.07,49.53 R19.2
  Bottom 0.254: v187.07,49.53 181.23,43.69 91.69,43.69 91.69,45.09 v90.93,45.09 | v87.12,50.16 85.47,51.82 83.31,51.82 82.42,52.7 U$19.LED
N$38
  Top 0.254: R19.1 190.08,50.99 LED19.A
N$39  (via drill 0.51)
  Top 0.254: v203.58,49.53 R20.2
  Bottom 0.254: v203.58,49.53 201.29,51.82 100.33,51.82 99.44,52.7 U$20.LED
N$40
  Top 0.254: R20.1 206.59,50.99 LED20.A
N$41
  Top 0.254: R30.1 207.01,19.05 207.01,20.09 LED30.A
N$42  (via drill 0.51)
  Top 0.254: v203.58,19.05 R30.2
  Bottom 0.254: v203.58,19.05 202.31,17.78 105.03,17.78 102.49,20.32 100.33,20.32 99.44,21.21 U$30.LED
N$43  (via drill 0.51)
  Top 0.254: v172.34,16.64 173.86,18.16 173.86,19.05 R29.2
  Bottom 0.254: v172.34,16.64 170.18,14.48 97.66,14.48 95,17.14 95,17.78 88.01,17.78 85.47,20.32 83.31,20.32 82.42,21.21 U$29.LED
N$44
  Top 0.254: R29.1 190.08,20.51 LED29.A
N$45
  Top 0.254: R28.1 172.3,20.51 LED28.A
N$46  (via drill 0.51)
  Top 0.254: v169.29,19.05 R28.2
  Bottom 0.254: v169.29,19.05 168.02,20.32 105.28,20.32 102.74,22.86 66.29,22.86 65.41,21.97 U$28.LED
N$47  (via drill 0.51)
  Top 0.254: v54.48,17.27 54.48,12.7 135.38,12.7 140.84,18.16 140.84,19.05 R27.2
  Bottom 0.254: v54.48,17.27 51.44,20.32 49.28,20.32 48.39,21.21 U$27.LED
N$48
  Top 0.254: R27.1 155.79,20.51 LED27.A
N$49  (via drill 0.51)
  Top 0.254: v112.65,13.59 115.32,16.26 115.32,19.05 R26.2
  Bottom 0.254: v112.65,13.59 112.27,13.97 40.77,13.97 34.42,20.32 32.26,20.32 31.37,21.21 U$26.LED
N$50
  Top 0.254: R26.1 139.28,20.51 LED26.A
N$51  (via drill 0.51)
  Top 0.254: v203.58,34.29 R25.2
  Bottom 0.254: v203.58,34.29 202.06,35.81 112.14,35.81 111.89,36.07 100.33,36.07 99.44,36.96 U$25.LED
N$52
  Top 0.254: R25.1 207.01,34.29 207.01,35.33 LED25.A
N$53  (via drill 0.51)
  Top 0.254: v174.24,36.7 174.24,34.29 R24.2
  Bottom 0.254: v174.24,36.7 172.34,38.61 83.31,38.61 82.42,37.72 U$24.LED
N$54
  Top 0.254: R24.1 190.08,35.75 LED24.A
N$55  (via drill 0.51)
  Top 0.254: v62.1,26.67 61.85,26.42 61.85,14.1 111.89,14.1 114.81,17.02 114.81,34.29 R21.2
  Bottom 0.254: v62.1,26.67 60.83,27.94 57.02,27.94 51.82,33.15 51.82,33.53 36.96,33.53 34.42,36.07 32.26,36.07 31.37,36.96 U$21.LED
N$56
  Top 0.254: R21.1 139.28,35.75 LED21.A
N$57  (via drill 0.51)
  Top 0.254: v135.38,27.94 140.84,33.4 140.84,34.29 R22.2
  Bottom 0.254: v135.38,27.94 74.04,27.94 68.83,33.15 68.83,33.53 53.98,33.53 51.44,36.07 49.28,36.07 48.39,36.96 U$22.LED
N$58
  Top 0.254: R22.1 155.79,35.75 LED22.A
N$59  (via drill 0.51)
  Top 0.254: v169.29,34.29 R23.2
  Bottom 0.254: v169.29,34.29 168.53,33.53 70.99,33.53 68.45,36.07 66.29,36.07 65.41,36.96 U$23.LED
N$60
  Top 0.254: R23.1 172.3,35.75 LED23.A
N$61
  Top 1.422: F1.1 92.71,113.03 87.63,118.11 U$38.GND
N$64
  Top 1.422: U$37.GND F2.1
N$65
  Top 1.422: F3.1 20.32,26.54 U$47.GND
RAW
  Top 1.422: U$38.OUT 79.01,113.3 J1.PWR 31.48,111.76 19.05,111.76 17.78,110.49 U$37.OUT 17.78,87.63 13.97,83.82 13.97,40.64 22.86,31.75 U$47.OUT
RST  (via drill 0.51)
  Top 0.254: v35.05,93.73 35.05,87.5 33.91,87.5 U$2.RST | v96.27,41.15 95.89,41.53 95.89,53.98 v96.27,54.36 95.89,54.61 95.89,72.64 | 95.89,72.64 99.31,72.64 100.2,71.75 U$15.RST | 95.89,88.39 99.31,88.39 100.2,87.5 U$10.RST | 95.89,72.64 95.89,88.39 | 95.89,88.39 95.89,104.14 99.31,104.14 100.2,103.25 U$1.RST | S1.3 175.64,10.79 175.64,12.7 R31.1 173.1,12.95 172.85,12.95 172.85,14.22 v164.21,22.86
  Bottom 0.254: U$2.RST 33.91,87.5 33.91,87.76 39.37,87.76 40.01,88.39 48.26,88.39 49.15,87.5 U$3.RST 50.93,86.74 51.94,86.74 52.83,85.85 65.28,85.85 66.17,86.74 U$4.RST 67.94,87.5 68.96,87.5 69.85,88.39 82.3,88.39 83.19,87.5 U$9.RST | 35.05,103.76 39.62,103.76 40.01,104.14 48.26,104.14 49.15,103.25 U$6.RST 50.93,103.25 51.94,103.25 52.83,104.14 65.28,104.14 66.17,103.25 U$7.RST 67.94,103.25 68.96,103.25 69.85,104.14 82.3,104.14 83.19,103.25 U$8.RST 84.96,103.25 85.98,103.25 86.87,104.14 99.31,104.14 100.2,103.25 U$1.RST | 35.05,103.76 33.91,103.76 33.91,103.25 U$5.RST | 35.05,103.76 v35.05,93.73 | 35.05,70.1 35.05,70.99 33.91,70.99 U$11.RST | 35.05,56.9 35.05,70.1 | 35.05,56.9 35.05,56.77 34.8,56.52 33.91,56.52 33.91,56.01 U$16.RST 32.13,55.24 31.24,54.36 28.83,54.36 28.32,53.85 28.32,41.15 | 35.05,56.9 48.26,56.9 49.15,56.01 U$17.RST 50.93,56.01 51.94,56.01 52.83,56.9 65.28,56.9 66.17,56.01 U$18.RST 67.94,56.01 68.96,56.01 69.85,56.9 82.3,56.9 83.19,56.01 U$19.RST | 35.05,70.1 48.26,70.1 49.15,70.99 U$12.RST 50.93,71.75 51.94,71.75 52.83,72.64 65.28,72.64 66.17,71.75 U$13.RST 67.94,71.75 68.96,71.75 69.85,72.64 82.3,72.64 83.19,71.75 U$14.RST | U$25.RST 100.2,40.26 99.31,41.15 v96.27,41.15 89.92,41.15 89.03,40.26 84.96,40.26 U$24.RST 83.19,40.26 82.3,41.15 69.85,41.15 68.96,40.26 67.94,40.26 U$23.RST 66.17,40.26 65.28,41.15 56.13,41.15 55.24,40.26 50.93,40.26 U$22.RST 49.15,40.26 48.26,41.15 40.01,41.15 39.62,40.77 33.91,40.77 33.91,40.26 U$21.RST 32.13,40.26 31.24,41.15 28.32,41.15 | v96.27,54.36 99.31,54.36 100.2,55.24 U$20.RST
  Bottom 0.254: v164.21,22.86 103.89,22.86 103,23.75 101.98,23.75 U$30.RST 100.2,24.51 99.31,25.4 86.87,25.4 85.98,24.51 84.96,24.51 U$29.RST 83.19,24.51 82.3,25.4 69.85,25.4 68.96,24.51 67.94,24.51 U$28.RST 66.17,24.51 65.28,25.4 52.83,25.4 51.94,24.51 50.93,24.51 U$27.RST 49.15,24.51 48.26,25.4 40.01,25.4 39.62,25.02 33.91,25.02 33.91,24.51 U$26.RST 32.13,24.51 31.24,25.4 28.32,25.4 28.32,41.15
VCC  (via drill 0.51)
  Top 0.254: v157.99,23.75 157.99,12.7 R31.2 | v105.03,25.4 102.49,27.94 99.82,27.94 99.82,29.97 98.81,30.99 96.01,30.99 96.01,39.62 96.65,40.26 97.16,40.26 97.16,41.78 96.9,41.78 96.9,42.04 96.39,42.04 96.39,48.39 v96.77,48.77 | 45.53,92.27 45.59,92.33 46.61,92.33 U$3.MICROVCC | 45.53,92.27 44.83,91.57 44.83,76.83 46.61,76.83 U$12.MICROVCC | 44.83,107.57 46.61,107.57 U$6.MICROVCC | 44.83,107.57 44.83,92.96 45.53,92.27 | 44.83,107.57 43.94,108.46 43.94,109.22 43.18,109.98 30.86,109.98 30.86,108.84 U$5.MICROVCC | 62.55,92.27 62.61,92.33 63.63,92.33 U$4.MICROVCC | 62.55,92.27 61.85,91.57 61.85,76.83 63.63,76.83 U$13.MICROVCC | U$7.MICROVCC 63.63,107.57 61.85,107.57 61.85,92.96 62.55,92.27 | 78.87,91.82 80.64,91.82 U$9.MICROVCC | 78.87,91.82 78.87,79.25 80.26,77.85 80.64,77.85 80.64,76.83 U$14.MICROVCC | 78.87,91.82 78.87,107.57 80.64,107.57 U$8.MICROVCC | v96.77,56.26 96.39,56.64 96.39,64.14 v96.77,64.52
  Top 1.422: 26.67,107.95 21.59,107.95 20.32,106.68 F2.2 | 26.67,107.95 U$5.MICROVCC | U$11.MICROVCC 28.96,76.45 26.67,78.74 26.67,92.71 | 26.67,92.71 26.67,107.95 | U$2.MICROVCC 27.18,92.2 26.67,92.71
  Bottom 0.254: v157.99,23.75 156.34,25.4 v105.03,25.4 | 95.82,75.25 96.65,76.07 97.66,76.07 U$15.MICROVCC | 95.82,75.25 95.76,75.18 83.31,75.18 82.42,76.07 U$14.MICROVCC | U$10.MICROVCC 97.66,92.58 97.66,93.47 87.76,93.47 85.98,91.69 85.98,90.93 83.31,90.93 82.42,91.82 U$9.MICROVCC | U$1.MICROVCC 98.17,108.84 98.17,109.98 89.03,109.98 85.72,106.68 83.31,106.68 82.42,107.57 U$8.MICROVCC 80.64,108.33 79.63,108.33 77.98,109.98 64.9,109.98 | 64.9,109.98 64.9,108.84 U$7.MICROVCC | 64.9,109.98 57.66,109.98 54.36,106.68 49.28,106.68 48.39,107.57 U$6.MICROVCC | v96.77,48.77 95.38,50.16 95.38,56.26 v96.77,56.26 | v96.77,64.52 95.89,65.41 95.89,75.18 95.82,75.25
VCC-2
  Top 0.254: 79.57,45.02 79.63,45.09 80.64,45.09 U$24.MICROVCC | 79.57,45.02 78.87,44.32 78.87,29.59 80.64,29.59 U$29.MICROVCC | U$19.MICROVCC 80.64,60.33 78.87,60.33 78.87,45.72 79.57,45.02 | 45.53,45.02 45.59,45.09 46.61,45.09 U$22.MICROVCC | 45.53,45.02 44.83,44.32 44.83,29.59 46.61,29.59 U$27.MICROVCC | U$17.MICROVCC 46.61,60.33 44.83,60.33 44.83,45.72 45.53,45.02 | 62.55,45.02 62.61,45.09 63.63,45.09 U$23.MICROVCC | 62.55,45.02 61.85,44.32 61.85,29.59 63.63,29.59 U$28.MICROVCC | U$18.MICROVCC 63.63,60.33 61.85,60.33 61.85,45.72 62.55,45.02
  Top 1.422: 26.67,29.21 26.67,26.67 25.4,25.4 F3.2 | 26.67,29.21 26.67,44.45 | U$21.MICROVCC 27.18,44.96 26.67,44.45 | 26.67,29.21 U$26.MICROVCC | U$16.MICROVCC 27.69,60.71 26.67,59.69 26.67,44.45
  Bottom 0.254: U$25.MICROVCC 97.66,45.34 97.66,45.59 95.5,45.59 94.87,46.23 89.66,46.23 89.28,46.61 87,46.61 86.23,45.85 86.23,44.45 86.11,44.45 86.11,44.2 85.98,44.2 85.98,43.69 83.31,43.69 82.42,44.58 U$24.MICROVCC | U$20.MICROVCC 97.66,60.33 97.66,60.07 95.5,60.07 94.87,59.44 83.31,59.44 82.42,60.33 U$19.MICROVCC 80.64,60.33 80.64,60.07 78.49,60.07 77.85,59.44 66.29,59.44 65.41,60.33 U$18.MICROVCC 63.63,60.33 62.61,60.33 61.72,59.44 49.28,59.44 48.39,60.33 U$17.MICROVCC | U$26.MICROVCC 31.37,28.83 32.26,27.94 44.7,27.94 45.59,28.83 46.61,28.83 U$27.MICROVCC | U$30.MICROVCC 97.28,30.48 83.31,30.48 82.04,29.21 U$29.MICROVCC
VCC-6DOF
  Top 0.254: 78.36,32.77 76.83,32.77 U$23.BRDVCC | 78.36,32.77 78.36,46.99 78.3,47.05 | 78.3,47.05 77.85,47.5 76.83,47.5 U$18.BRDVCC | 78.36,63.25 76.83,63.25 U$13.BRDVCC | 78.36,63.25 78.36,47.12 78.3,47.05 | 78.36,78.99 76.83,78.99 U$4.BRDVCC | 78.36,63.25 78.36,78.99 | 78.36,78.99 78.36,94.74 76.83,94.74 U$7.BRDVCC | 61.21,32.77 61.34,32.77 61.34,46.99 61.28,47.05 | 61.21,32.77 59.82,32.77 U$22.BRDVCC | 61.28,47.05 60.83,47.5 59.82,47.5 U$17.BRDVCC | 61.34,63.25 59.82,63.25 U$12.BRDVCC | 61.34,63.25 61.34,47.12 61.28,47.05 | 61.34,78.99 59.82,78.99 U$3.BRDVCC | 61.34,63.25 61.34,78.99 | 61.34,78.99 61.34,94.74 59.82,94.74 U$6.BRDVCC | 44.32,32.77 42.8,32.77 U$21.BRDVCC | 44.32,32.77 44.32,46.99 44.26,47.05 | 44.26,47.05 43.81,47.5 42.8,47.5 U$16.BRDVCC | 44.32,63.25 42.8,63.25 U$11.BRDVCC | 44.32,63.25 44.32,47.12 44.26,47.05 | 44.32,78.99 42.8,78.99 U$2.BRDVCC | 44.32,63.25 44.32,78.99 | 44.32,78.99 44.32,94.74 42.8,94.74 U$5.BRDVCC | 95.38,32.77 93.85,32.77 U$24.BRDVCC | 95.38,32.77 95.38,46.99 95.31,47.05 | 95.31,47.05 94.87,47.5 93.85,47.5 U$19.BRDVCC | 95.38,63.25 93.85,63.25 U$14.BRDVCC | 95.38,63.25 95.38,47.12 95.31,47.05 | 95.38,78.99 93.85,78.99 U$9.BRDVCC | 95.38,63.25 95.38,78.99 | 95.38,94.74 93.85,94.74 U$8.BRDVCC | 95.38,78.99 95.38,94.74 | 95.38,32.77 95.38,17.02 93.85,17.02 U$29.BRDVCC | 44.32,32.77 44.32,17.53 43.81,17.02 42.8,17.02 U$26.BRDVCC | 61.21,32.77 61.21,26.04 61.34,25.91 61.34,17.53 60.83,17.02 59.82,17.02 U$27.BRDVCC | 78.36,32.77 78.36,17.53 77.85,17.02 76.83,17.02 U$28.BRDVCC | 95.38,94.74 95.38,110.49 96.14,111 105.16,111 105.66,111.51 105.66,112.91 F1.2
  Top 1.422: 113.03,33.02 113.03,19.05 111.76,16.51 U$30.BRDVCC | 113.03,48.26 113.03,33.02 | 113.03,63.5 113.03,48.26 | 113.03,80.01 113.03,63.5 | 113.03,95.25 113.03,80.01 | 113.03,95.25 113.03,110.49 110.49,113.03 F1.2 | U$25.BRDVCC 112.27,32.26 arc90 113.03,33.02 | U$20.BRDVCC 112.78,48.01 arc90 113.03,48.26 | U$15.BRDVCC 112.78,63.75 arc-90 113.03,63.5 | U$10.BRDVCC 112.52,79.5 arc90 113.03,80.01 | 113.03,95.25 U$1.BRDVCC
  Bottom 0.254: U$26.BRDVCC 42.8,15.62 45.47,15.62 46.61,14.48 55.5,14.48 57.02,16 58.04,16 U$27.BRDVCC 59.82,16 60.83,16 62.36,14.48 67.94,14.48 69.09,15.62 75.06,15.62 U$28.BRDVCC 76.83,16 77.85,16 79.38,14.48 84.96,14.48 86.11,15.62 92.08,15.62 U$29.BRDVCC

### Text on the board
tPlace: 7V | 6DOF | 6DOF | 6DOF | 6DOF | 6DOF | Digital | Digital | Digital | Digital | Digital | 6DOF | 6DOF | 6DOF | 6DOF | 6DOF | Digital | Digital | Digital | Digital | Digital | 6DOF | 6DOF | 6DOF | 6DOF | 6DOF | Digital | Digital | Digital | Digital | Digital | 6DOF | 6DOF | 6DOF | 6DOF | 6DOF | Digital | Digital | Digital | Digital | Digital | 6DOF | 6DOF | 6DOF | 6DOF | 6DOF | Digital | Digital | Digital | Digital | Digital | 6DOF | 6DOF | 6DOF | 6DOF | 6DOF | Digital | Digital | Digital | Digital | Digital | RESET
bPlace: INT0 | INT0 | INT0 | INT0 | INT0 | INT1 | INT1 | INT1 | INT1 | INT1 | SCL | SCL | SCL | SCL | SCL | SDA | SDA | SDA | SDA | SDA | GND | GND | GND | GND | GND | 3.3V | 3.3V | 3.3V | 3.3V | 3.3V | INT0 | INT0 | INT0 | INT0 | INT0 | INT1 | INT1 | INT1 | INT1 | SCL | SCL | SCL | SCL | SCL | SDA | SDA | SDA | SDA | SDA | GND | GND | GND | GND | GND | 3.3V | 3.3V | 3.3V | 3.3V | 3.3V
tValues: A. Weiss